# EAGLE schematic AXAWIFI (EAGLE 9.6.1)
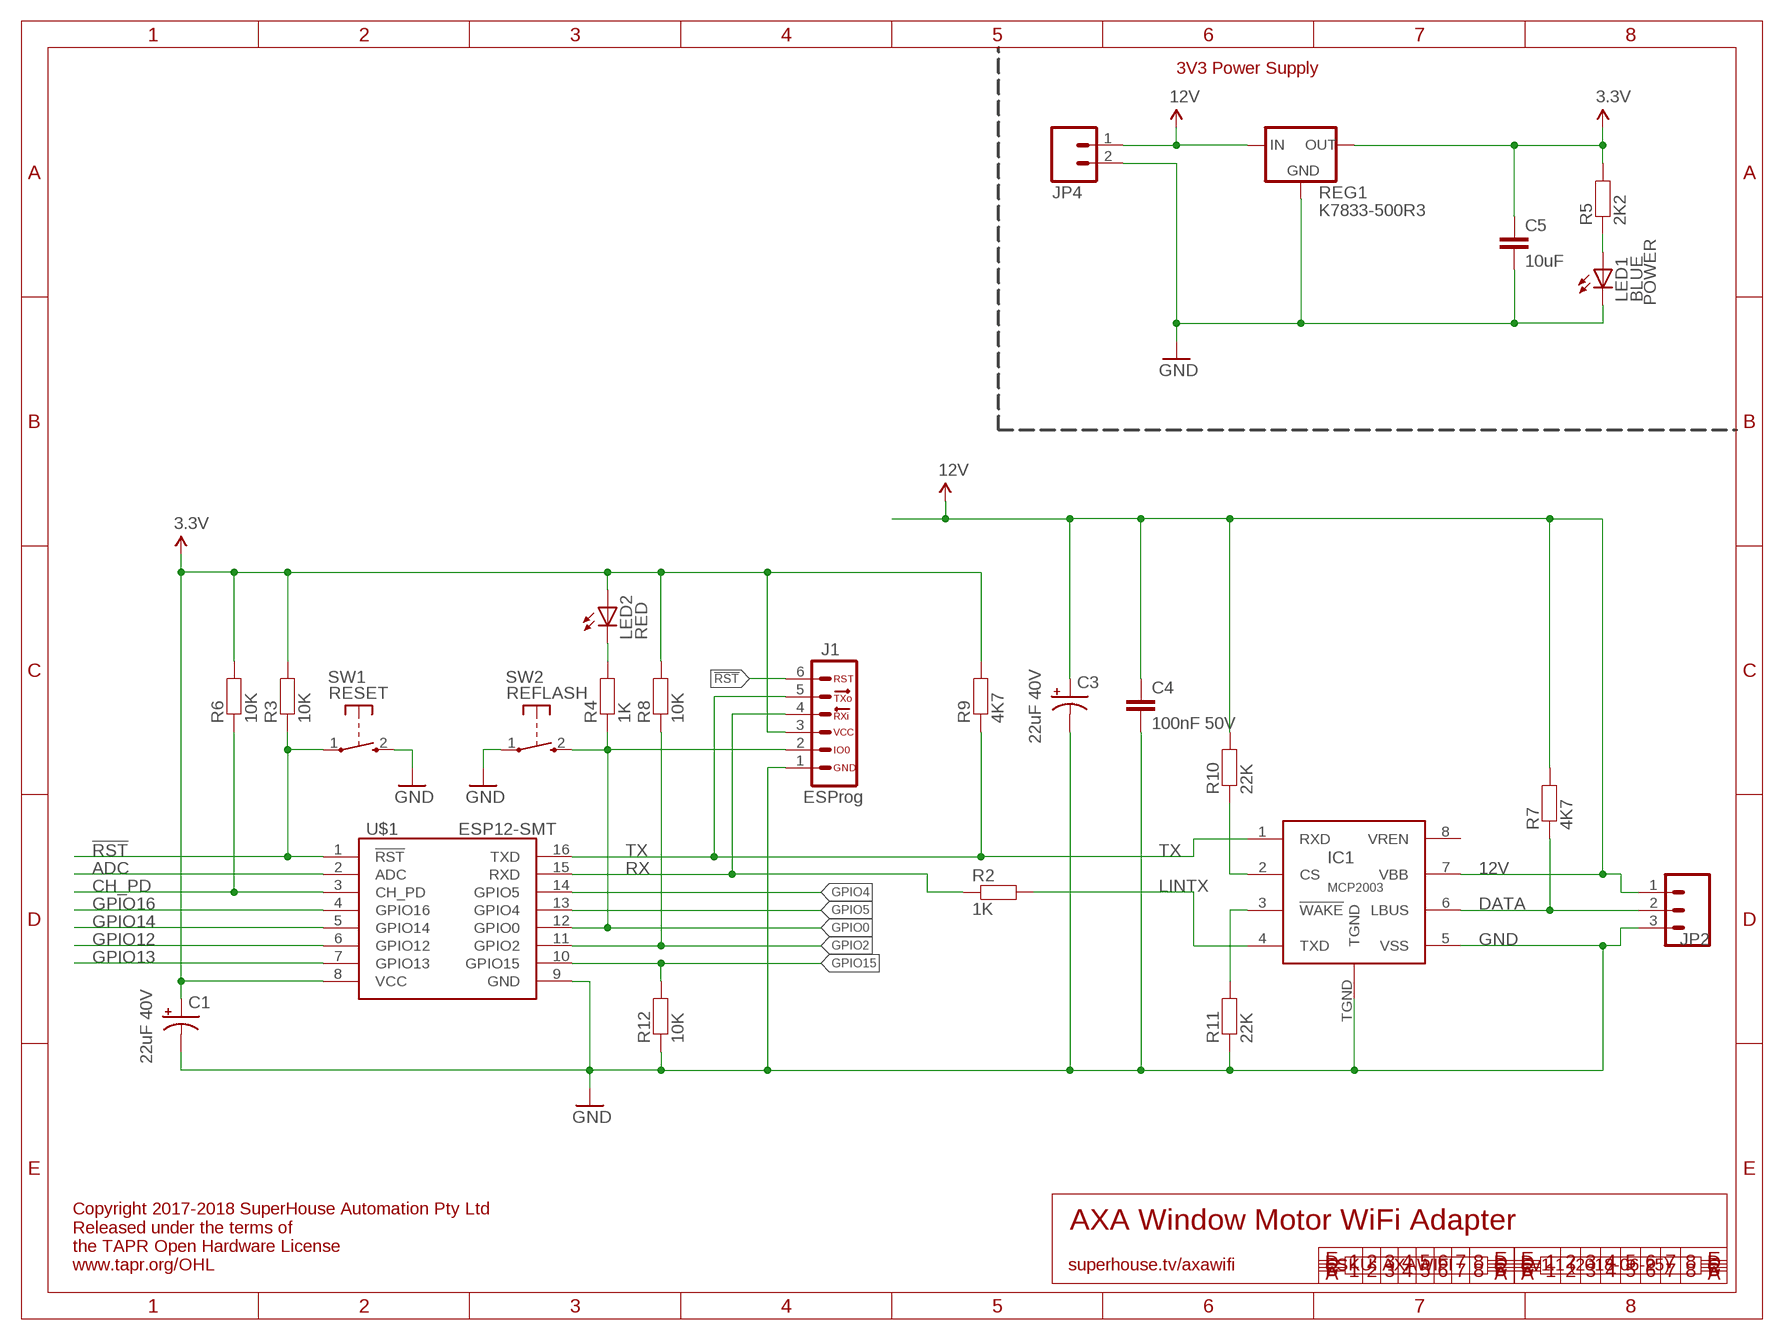
[diagram p0: schematic, sheet 1]

## Parts
C1  22uF 40V  CAP_POLC  [PANASONIC_C]
C3  22uF 40V  CAP_POLC  [PANASONIC_C]
C4  100nF 50V  CAP0603  [C0603]
C5  10uF  CAP0805  [C0805]
IC1  MCP2003  [SOIC8T]
J1  ESPROG-SOCKET  [ESPROG-S]
JP2  M03-PLAIN  [1X03]
JP4  M02-SCREW-3.5MM  [SCREWTERMINAL-3.5MM-2]
LED1  BLUE  LED0603  [LED-0603]
LED2  RED  LED0603  [LED-0603]
R2  1K  RESISTOR0603  [R0603]
R3  10K  RESISTOR0603  [R0603]
R4  1K  RESISTOR0603  [R0603]
R5  2K2  RESISTOR0603  [R0603]
R6  10K  RESISTOR0603  [R0603]
R7  4K7  RESISTOR0603  [R0603]
R8  10K  RESISTOR0603  [R0603]
R9  4K7  RESISTOR0603  [R0603]
R10  22K  RESISTOR0603  [R0603]
R11  22K  RESISTOR0603  [R0603]
R12  10K  RESISTOR0603  [R0603]
REG1  K7833-500R3  K78XX-500R3  [K78XX-500R3]
SW1  RESET  TAC_SWITCH_2PINSMT  [TACTILE_SMT_3X4X2]
SW2  REFLASH  TAC_SWITCH_2PINSMT  [TACTILE_SMT_3X4X2]
U$1  ESP12-SMT  [ESP12]

## Nets
3.3V: C1.+ C5.1 J1.3 LED2.A R3.2 R5.2 R6.2 R8.2 R9.2 REG1.3(OUT) U$1.8(VCC)
12V: C3.+ C4.1 IC1.7(VBB) JP2.1 JP4.1 R7.2 R10.2 REG1.1(IN)
!RST: J1.6 R3.1 SW1.1(P) U$1.1(!RST)
ADC: U$1.2(ADC)
CH_PD: R6.1 U$1.3(CH_PD)
DATA: IC1.6(LBUS) JP2.2 R7.1
GND: C1.- C3.- C4.2 C5.2 IC1.5(VSS) IC1.TGND J1.1 JP2.3 JP4.2 LED1.C R11.1 R12.1 REG1.2(GND) SW1.2(S) SW2.1(P) U$1.9(GND)
GPIO0: J1.2 R4.1 SW2.2(S) U$1.12(GPIO0)
GPIO2: R8.1 U$1.11(GPIO2)
GPIO4: U$1.14(GPIO5)
GPIO5: U$1.13(GPIO4)
GPIO12: U$1.6(GPIO12)
GPIO13: U$1.7(GPIO13)
GPIO14: U$1.5(GPIO14)
GPIO15: R12.2 U$1.10(GPIO15)
GPIO16: U$1.4(GPIO16)
LINTX: IC1.4(TXD) R2.2
N$5: IC1.2(CS) R10.1
N$6: IC1.3(!WAKE) R11.2
N$14: LED1.A R5.1
N$20: LED2.C R4.2
RX: J1.4 R2.1 U$1.15(RXD)
TX: IC1.1(RXD) J1.5 R9.1 U$1.16(TXD)
Unconnected: IC1.8(VREN)

## Notes on the sheet
- 3V3 Power Supply
- POWER
- AXA Window Motor WiFi Adapter
- Copyright 2017-2018 SuperHouse Automation Pty Ltd
  Released under the terms of
  the TAPR Open Hardware License
  www.tapr.org/OHL
- superhouse.tv/axawifi | SKU: AXAWIFI | v1.1 (2018-06-25)

## Library data of the parts
C1 C3 = SuperHouse-DiscreteSemi:CAP_POL: Capacitor Polarized These are standard SMD and PTH capacitors. Normally 10uF, 47uF, and 100uF in electrolytic and tantalum varieties. Always verify the external diameter of the through hole cap, it varies with capacity, voltage, and manufacturer. The EIA devices should be standard.
C4 C5 = SuperHouse-DiscreteSemi:CAP: Capacitor Standard ceramic capacitor
IC1 = SuperHouse-ICs:MCP2003: MCP2003 LIN bus driver
J1 = SuperHouse-Connectors:ESPROG: ESProg ESProg ESP8266 / ESP32 Programming Header
JP2 = SuperHouse-Connectors:M03: 3-way header Standard 1x3 header, and screw terminal variations
JP4 = SuperHouse-Connectors:M02: 2-way header Standard 1x2 header, and screw terminal variations
LED1 LED2 = SuperHouse-LEDs:LED: LEDs Standard schematic elements and footprints for 5mm, 3mm, 1206, and 0603 sized LEDs. 5mm - Spark Fun Electronics SKU : COM-00529 (and others)
R2-R12 = SuperHouse-DiscreteSemi:RESISTOR: Resistor Standard resistors.
REG1 = SuperHouse-Regulators:K78XX-500R3: K78xx-500R3 switchmode voltage regulator
SW1 SW2 = SuperHouse-Switches:TAC_SWITCH_2PIN: Momentary Tactile Switch - 2 pin Uxcell 3x4x2mm switch with 2 SMT pads
U$1 = SuperHouse-MCUs:ESP12: ESP-12 module